# EasyEDA Pro project WKMiniFlyG4.epro

# Schematic Schematic1
Board Name: Board1; Create Date: 2025-02-15; Page Name: P1; Project Name: WKMiniFlyG4; Schematic Name: Schematic1; Update Date: 2025-03-20; Company: 嘉立创EDA; Page Size: A4; Version: V1.0
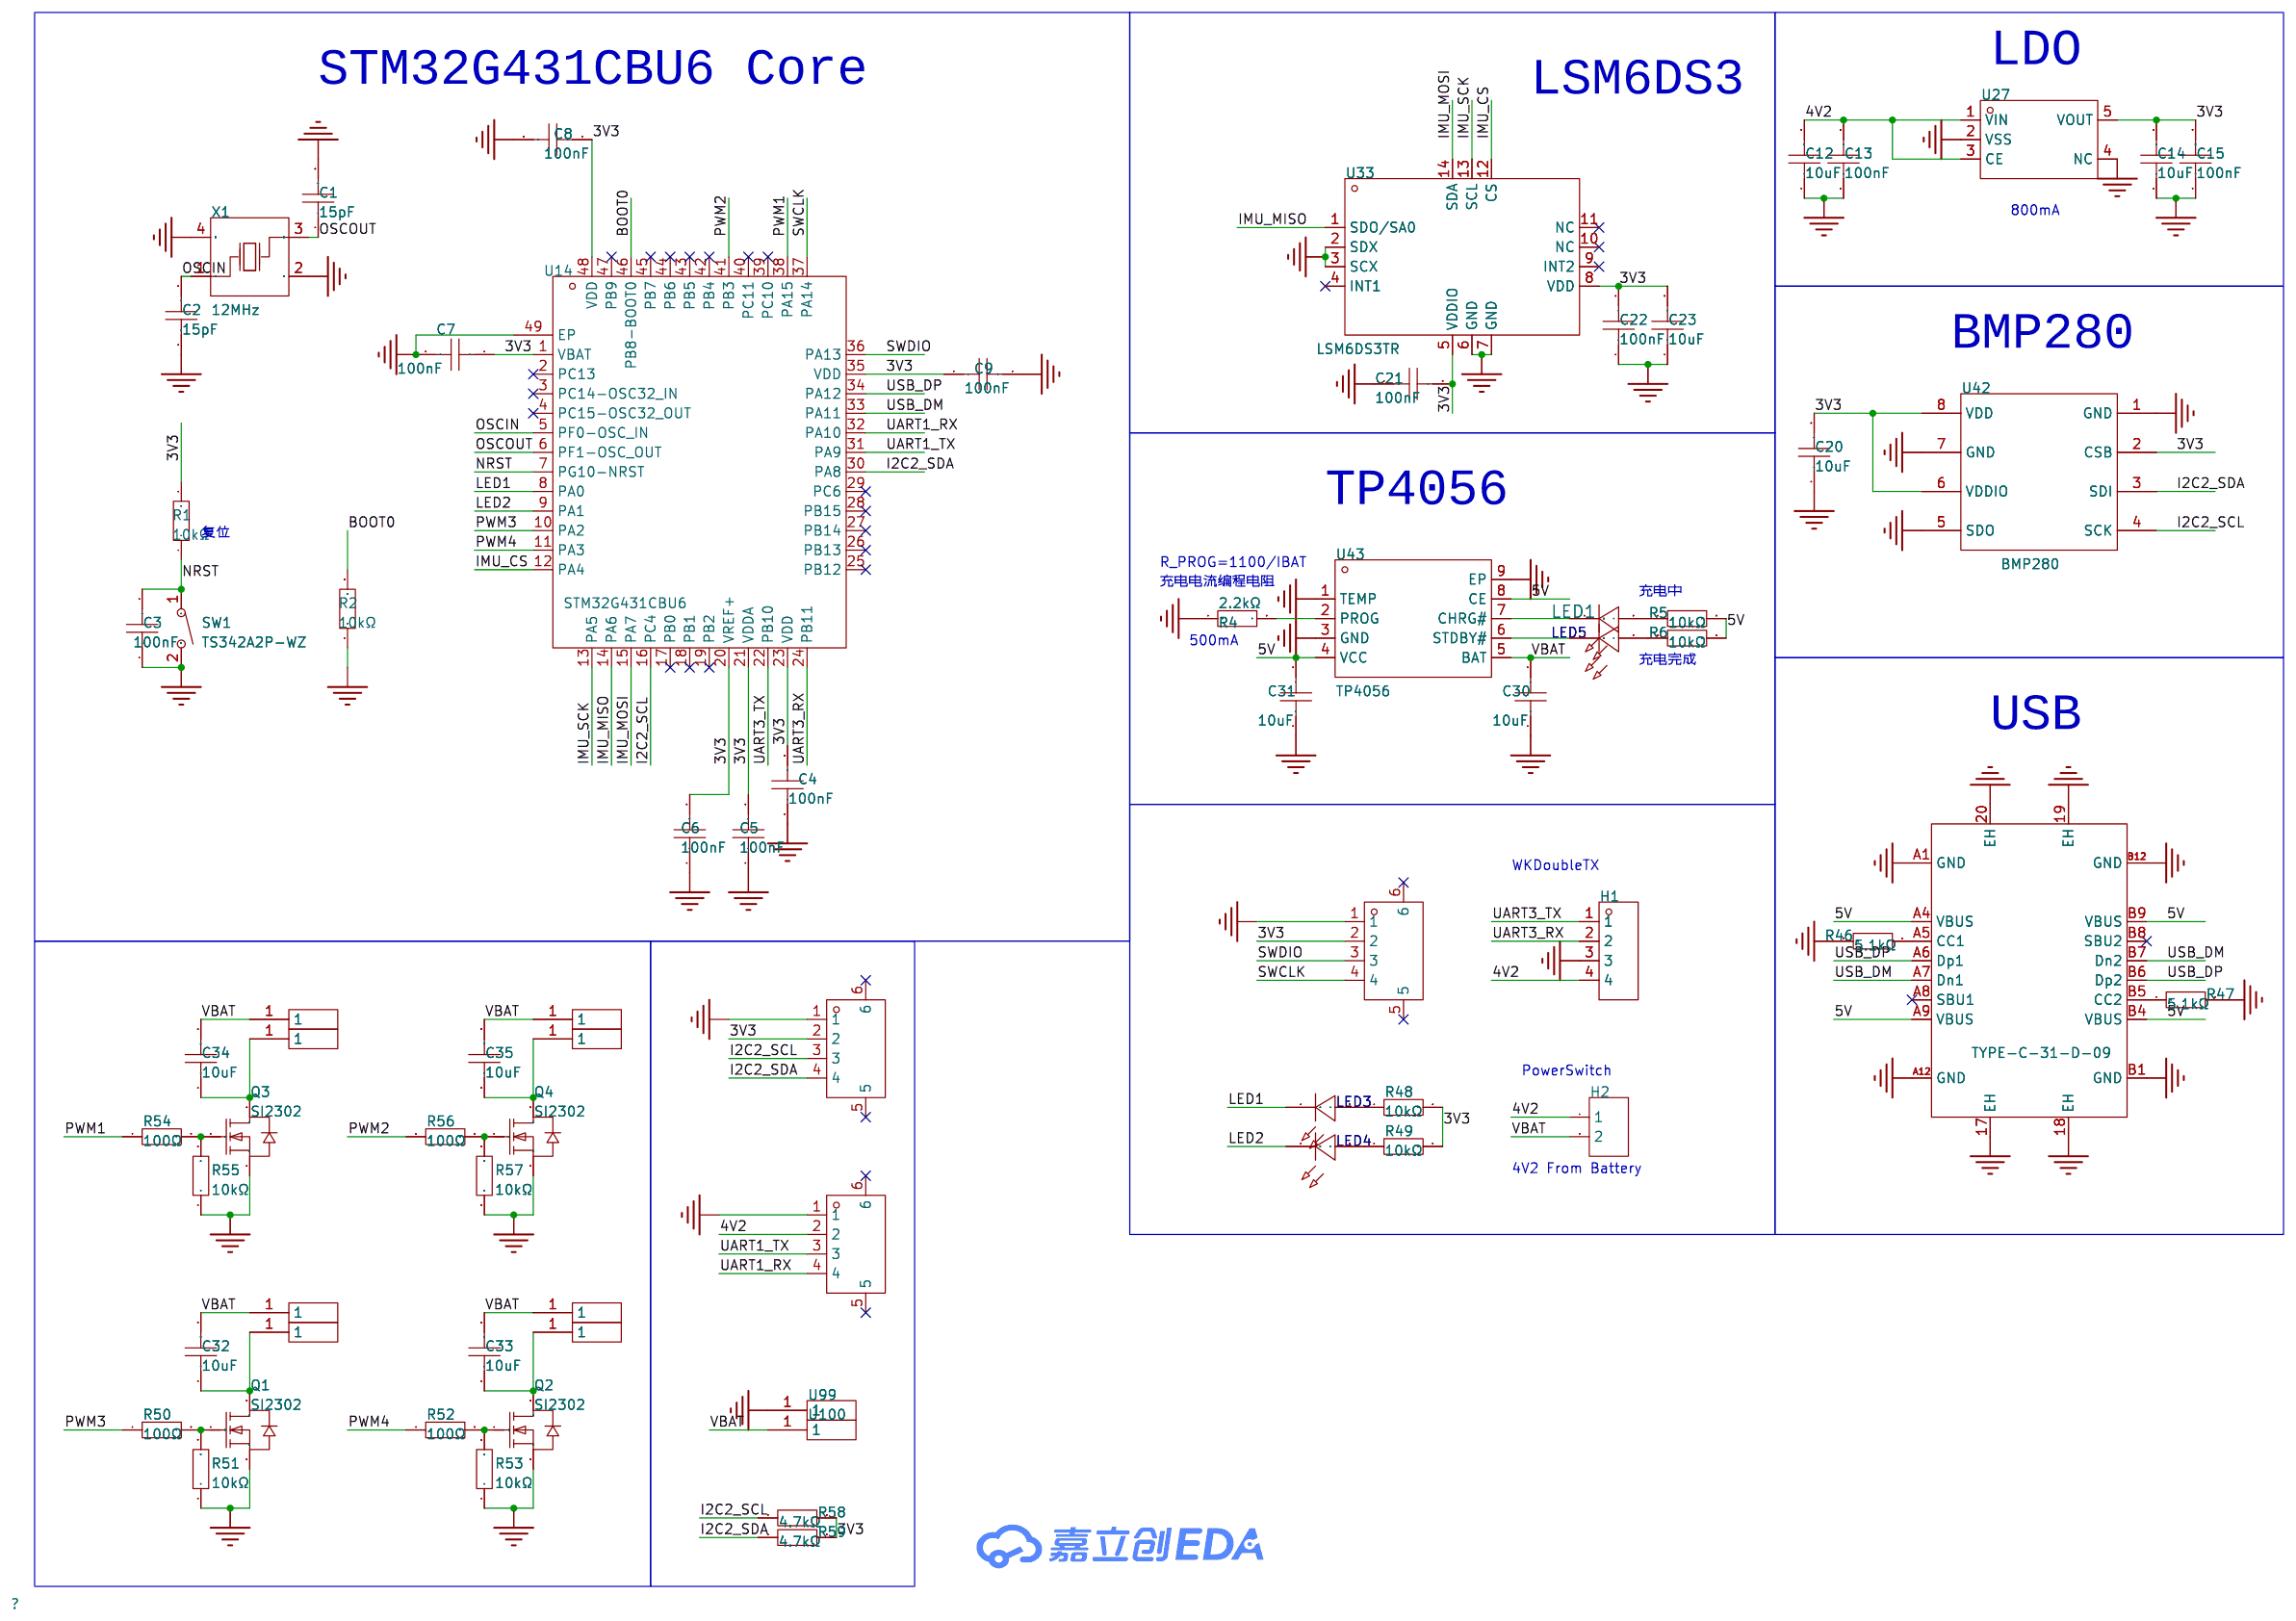
[diagram p0: schematic sheet]

## Parts
C1  15pF  [C0603]
C2  15pF  [C0603]
C3  100nF  [C0603]
C4  100nF  [C0603]
C5  100nF  [C0603]
C6  100nF  [C0603]
C7  100nF  [C0603]
C8  100nF  [C0603]
C9  100nF  [C0603]
C12  10uF  [C0603]
C13  100nF  [C0603]
C14  10uF  [C0603]
C15  100nF  [C0603]
C20  10uF  [C0603]
C21  100nF  [C0603]
C22  100nF  [C0603]
C23  10uF  [C0603]
C30  10uF  [C0603]
C31  10uF  [C0603]
C32  10uF  [C0603]
C33  10uF  [C0603]
C34  10uF  [C0603]
C35  10uF  [C0603]
H1  -  [HDR-TH_4P-P2.54-V-M]
H2  -  [HDR-TH_2P-P2.54-V-F]
LED1  -  [LED_0603]
LED3  -  [LED_0603]
LED4  -  [LED_0603]
LED5  -  [LED_0603]
Q1  SI2302  [SOT-23-3_L2.9-W1.3-P1.90-LS2.4-BR]
Q2  SI2302  [SOT-23-3_L2.9-W1.3-P1.90-LS2.4-BR]
Q3  SI2302  [SOT-23-3_L2.9-W1.3-P1.90-LS2.4-BR]
Q4  SI2302  [SOT-23-3_L2.9-W1.3-P1.90-LS2.4-BR]
R1  10kΩ  [R0603]
R2  10kΩ  [R0603]
R4  2.2kΩ  [R0603]
R5  10kΩ  [R0603]
R6  10kΩ  [R0603]
R46  5.1kΩ  [R0603]
R47  5.1kΩ  [R0603]
R48  10kΩ  [R0603]
R49  10kΩ  [R0603]
R50  100Ω  [R0603]
R51  10kΩ  [R0603]
R52  100Ω  [R0603]
R53  10kΩ  [R0603]
R54  100Ω  [R0603]
R55  10kΩ  [R0603]
R56  100Ω  [R0603]
R57  10kΩ  [R0603]
R58  4.7kΩ  [R0603]
R59  4.7kΩ  [R0603]
SW1  TS342A2P-WZ  [SW-SMD_L4.0-W2.9-LS5.0]
U14  STM32G431CBU6  [UFQFPN-48_L7.0-W7.0-P0.50-BL-EP]
U27  ME6217C33M5G  [SOT-23-5_L3.0-W1.7-P0.95-LS2.8-BR]
U33  LSM6DS3TR  [LGA-14_L3.0-W2.5-P0.50-TL]
U39  ZX-SH1.0-4PWT  [CONN-SMD_4P-P1.00_MEGASTAR_ZX-SH1.0-4PWT]
U41  ZX-SH1.0-4PWT  [CONN-SMD_4P-P1.00_MEGASTAR_ZX-SH1.0-4PWT]
U42  BMP280  [LGA-8_L2.5-W2.0-P0.65_AMP6127]
U43  TP4056  [ESOP-8_L4.9-W3.9-P1.27-LS6.0-BL-EP]
U89  TYPE-C-31-D-09  [USB-C-TH_TYPE-C-31-D-09]
U90  -  [1pin焊接引出]
U91  -  [1pin焊接引出]
U92  -  [1pin焊接引出]
U93  -  [1pin焊接引出]
U94  -  [1pin焊接引出]
U95  -  [1pin焊接引出]
U96  -  [1pin焊接引出]
U97  -  [1pin焊接引出]
U98  ZX-SH1.0-4PWT  [CONN-SMD_4P-P1.00_MEGASTAR_ZX-SH1.0-4PWT]
U99  -  [1pin焊接引出]
U100  -  [1pin焊接引出]
X1  12MHz  [OSC-SMD_4P-L3.2-W2.5-BL]

## Library data of the parts
C1 C2 = CL10C150JB8NNNC: 容值:15pF;精度:±5%;额定电压:50V;材质(温度系数):C0G;; LCSC Part Name: 15pF ±5% 50V; Supplier Part: C1644; Manufacturer: SAMSUNG(三星); Supplier Footprint: 0603; JLCPCB Part Class: Basic Part; Datasheet: https://atta.szlcsc.com/upload/public/pdf/source/20160218/1457707763339.pdf; Supplier: LCSC; Tolerance: ±5%; Voltage Rated: 50V; Temperature Coefficient: C0G
C3-C9 C13 C15 C21 C22 = CC0603KRX7R9BB104: 容值:100nF;精度:±10%;额定电压:50V;材质(温度系数):X7R;; LCSC Part Name: 100nF ±10% 50V; Supplier Part: C14663; Manufacturer: YAGEO(国巨); Supplier Footprint: 0603; JLCPCB Part Class: Basic Part; Datasheet: https://atta.szlcsc.com/upload/public/pdf/source/20180910/C282072_33301C7F631E79921B82A8DAC6BCC5B3.pdf; Supplier: LCSC; Tolerance: ±10%; Voltage Rated: 50V; Temperature Coefficient: X7R
C12 C14 C20 C23 C30-C35 = CL10A106KP8NNNC: 容值:10uF;精度:±10%;额定电压:10V;材质(温度系数):X5R;; LCSC Part Name: 10uF ±10% 10V; Supplier Part: C19702; Manufacturer: SAMSUNG(三星); Supplier Footprint: 0603; JLCPCB Part Class: Basic Part; Datasheet: https://atta.szlcsc.com/upload/public/pdf/source/20160218/1457707763339.pdf; Supplier: LCSC; Tolerance: ±10%; Voltage Rated: 10V; Temperature Coefficient: X5R
H1 = HDR-M_2.54_1x4P: Supplier Part: C492403; Supplier Footprint: 插件
H2 = HDR-F_2.54_1x2P: Supplier Part: C49661; Supplier Footprint: 插件
LED1 = LED_0603-R: Supplier Footprint: 0603
LED3-LED5 = LED_0603-G: Supplier Footprint: 0603
Q1-Q4 = SI2302_C2891732: 类型:1个N沟道;漏源电压(Vdss):20V;连续漏极电流(Id):3A;导通电阻(RDS(on)@Vgs,Id):50mΩ@4.5V,3A;功率(Pd):1W;阈值电压(Vgs(th)@Id):1V@250uA;; LCSC Part Name: N沟道,电流:3A,耐压:20V; Supplier Part: C2891732; Manufacturer: YONGYUTAI(永裕泰); Supplier Footprint: SOT-23; JLCPCB Part Class: 扩展库; Datasheet: https://atta.szlcsc.com/upload/public/pdf/source/20210901/467BBA277A18343FF82D7D641AA41F7C.pdf; Supplier: LCSC; Type: 1个N沟道; Drain Source Voltage (Vdss): 20V; Continuous Drain Current (Id): 3A; Drain Source On Resistance (RDS(on)@Vgs,Id): 50mΩ@4.5V,3A; Power Dissipation (Pd): 1W; Gate Threshold Voltage (Vgs(th)@Id): 1V@250uA; Total Gate Charge (Qg@Vgs): 60nC@4.5V; Input Capacitance (Ciss@Vds): 300pF@10V; Reverse Transfer Capacitance (Crss@Vds): 80pF@10V; Operating Temperature: -55℃~+150℃
R1 R2 R5 R6 R48 R49 R51 R53 R55 R57 = 0603WAF1002T5E: 电阻类型:厚膜电阻;阻值:10kΩ;精度:±1%;功率:100mW;最大工作电压:75V;温度系数:±100ppm/℃;; LCSC Part Name: 厚膜电阻 10kΩ ±1% 100mW; Supplier Part: C25804; Manufacturer: UNI-ROYAL(厚声); Supplier Footprint: 0603; JLCPCB Part Class: Basic Part; Datasheet: https://atta.szlcsc.com/upload/public/pdf/source/20200306/C422600_1E6D84923E4A46A82E41ADD87F860B5C.pdf; Supplier: LCSC; Type: 厚膜电阻; Tolerance: ±1%; Power(Watts): 100mW; Overload Voltage (Max): 75V; Temperature Coefficient: ±100ppm/℃; Operating Temperature Range: -55℃~+155℃
R4 = 0603WAF2201T5E: 电阻类型:厚膜电阻;阻值:2.2kΩ;精度:±1%;功率:100mW;最大工作电压:75V;温度系数:±100ppm/℃;; LCSC Part Name: 2.2kΩ ±1% 100mW 厚膜电阻; Supplier Part: C4190; Manufacturer: UNI-ROYAL(厚声); Supplier Footprint: 0603; JLCPCB Part Class: Basic Part; Datasheet: https://atta.szlcsc.com/upload/public/pdf/source/20200306/C422600_1E6D84923E4A46A82E41ADD87F860B5C.pdf; Supplier: LCSC; Type: 厚膜电阻; Tolerance: ±1%; Power(Watts): 100mW; Overload Voltage (Max): 75V; Temperature Coefficient: ±100ppm/℃; Operating Temperature Range: -55℃~+155℃
R46 R47 = 0603WAF5101T5E: 电阻类型:厚膜电阻;阻值:5.1kΩ;精度:±1%;功率:100mW;最大工作电压:75V;温度系数:±100ppm/℃;; LCSC Part Name: 5.1kΩ ±1% 100mW 厚膜电阻; Supplier Part: C23186; Manufacturer: UNI-ROYAL(厚声); Supplier Footprint: 0603; JLCPCB Part Class: Basic Part; Datasheet: https://atta.szlcsc.com/upload/public/pdf/source/20200306/C422600_1E6D84923E4A46A82E41ADD87F860B5C.pdf; Supplier: LCSC; Type: 厚膜电阻; Tolerance: ±1%; Power(Watts): 100mW; Overload Voltage (Max): 75V; Temperature Coefficient: ±100ppm/℃; Operating Temperature Range: -55℃~+155℃
R50 R52 R54 R56 = 0603WAF1000T5E: 电阻类型:厚膜电阻;阻值:100Ω;精度:±1%;功率:100mW;最大工作电压:75V;温度系数:±200ppm/℃;; LCSC Part Name: 100Ω ±1% 100mW 厚膜电阻; Supplier Part: C22775; Manufacturer: UNI-ROYAL(厚声); Supplier Footprint: 0603; JLCPCB Part Class: Basic Part; Datasheet: https://atta.szlcsc.com/upload/public/pdf/source/20200306/C422600_1E6D84923E4A46A82E41ADD87F860B5C.pdf; Supplier: LCSC; Type: 厚膜电阻; Tolerance: ±1%; Power(Watts): 100mW; Overload Voltage (Max): 75V; Temperature Coefficient: ±200ppm/℃; Operating Temperature Range: -55℃~+155℃
R58 R59 = 0603WAF4701T5E: 电阻类型:厚膜电阻;阻值:4.7kΩ;精度:±1%;功率:100mW;最大工作电压:75V;温度系数:±100ppm/℃;; LCSC Part Name: 4.7kΩ ±1% 100mW 厚膜电阻; Supplier Part: C23162; Manufacturer: UNI-ROYAL(厚声); Supplier Footprint: 0603; JLCPCB Part Class: Basic Part; Datasheet: https://atta.szlcsc.com/upload/public/pdf/source/20200306/C422600_1E6D84923E4A46A82E41ADD87F860B5C.pdf; Supplier: LCSC; Type: 厚膜电阻; Tolerance: ±1%; Power(Watts): 100mW; Overload Voltage (Max): 75V; Temperature Coefficient: ±100ppm/℃; Operating Temperature Range: -55℃~+155℃
SW1 = TS342A2P-WZ: 电路结构:单刀单掷;按钮形状:圆形按钮;安装方式:立贴;开关长度:3.95mm;开关宽度:2.9mm;开关高度:2mm;带支架:不带;触点电流:50mA;额定电压(DC):12V;绝缘电阻:100MΩ;机械寿命:3万次;; LCSC Part Name: 3.95*2.9*2mm 立贴 轻触开关; Supplier Part: C557591; Manufacturer: SHOU HAN(首韩); Supplier Footprint: SMD; JLCPCB Part Class: 扩展库; Datasheet: https://atta.szlcsc.com/upload/public/pdf/source/20200519/C557591_B3A5A21584733303F06306F18577DA8B.pdf; Supplier: LCSC; Circuit: 单刀单掷; Actuator Style: 圆形按钮; Mounting Style: 立贴; Switch Length: 3.95mm; Switch Width: 2.9mm; Switch Height: 2mm; Strike Gundam: 不带; Contact Current: 50mA; Voltage Rating (DC): 12V; Insulation Resistance: 100MΩ; Actuator/Cap Color: 黑色; Pin Style: SMD接片; Mechanical Life: 3万次; Operating Temperature: -25℃~+70℃
U14 = STM32G431CBU6: CPU内核:ARM-M系列;程序存储容量:128KB;RAM总容量:32KB;GPIO端口数量:42;工作电压范围:1.71V~3.6V;CPU最大主频:170MHz;程序存储器类型:FLASH;; Supplier Part: C529356; Manufacturer: ST(意法半导体); Supplier Footprint: UFQFPN-48(7x7); JLCPCB Part Class: 扩展库; Datasheet: https://atta.szlcsc.com/upload/public/pdf/source/20200511/C529354_7C66CF00837B904D0C15DCE45B69418C.pdf; Supplier: LCSC; CPU Core: ARM-M系列; Program Storage Size: 128KB; RAM Size: 32KB; GPIO Ports Number: 42; Operating Voltage Range: 1.71V~3.6V; CPU Maximum Speed: 170MHz; Program Memory Type: FLASH; Operating Temperature Range: -40℃~+85℃; ADC (Bit): 12bit; DAC (Bit): 12bit; Peripheral/Function: DMA；PWM; Watchdog: 有; Infrared Data Association: 有; Low-Voltage Detect: 有; Direct Memory Access: 有; Internal Oscillator: 有
U27 = ME6217C33M5G: 输出类型:固定;输出极性:正;最大输入电压:7V;输出电压:3.3V;输出电流:800mA;电源纹波抑制比(PSRR):65dB@(1kHz);; Supplier Part: C427602; Manufacturer: MICRONE(南京微盟); Supplier Footprint: SOT-23-5; JLCPCB Part Class: 扩展库; Datasheet: https://atta.szlcsc.com/upload/public/pdf/source/20190910/C427602_D4B9162A2E9D9EF57C60010DFDECEF37.pdf; Supplier: LCSC; Output Type: 固定; Output Polarity: 正; Number of Outputs: 1; Maximum Input Voltage: 7V; Output Voltage: 3.3V; Dropout Voltage: 180mV@(300mA); Output Current: 800mA; Power Supply Rejection Ratio (PSRR): 65dB@(1kHz)
U33 = LSM6DS3TR: 传感器类型:加速度计陀螺仪;; LCSC Part Name: LSM6DS3TR MSL=3; Supplier Part: C95230; Manufacturer: ST(意法半导体); Supplier Footprint: LGA-14(2.5x3); JLCPCB Part Class: 扩展库; Datasheet: https://atta.szlcsc.com/upload/public/pdf/source/20180410/C95230_E9546B888C12D8CC6F7F231B3BE24882.pdf; Supplier: LCSC; Sensor Type: 加速度计陀螺仪; Operating Temperature: -40℃~+85℃
U39 U41 U98 = ZX-SH1.0-4PWT: 插针结构:1x4P;间距:1mm;安装方式:卧贴;参考系列:SH;总PIN数:4P;排数:1;每排PIN数:4;行距:-;额定电流:-;触头材质:黄铜;触头镀层:锡;工作温度范围:-;; LCSC Part Name: 1x4P 间距:1mm 卧贴 系列:SH; Supplier Part: C7430446; Manufacturer: Megastar(兆星); Supplier Footprint: SMD,P=1mm,卧贴; JLCPCB Part Class: 扩展库; Datasheet: https://atta.szlcsc.com/upload/public/pdf/source/20230619/390816C24B7A0EB1D042395C380CEA99.pdf; Supplier: LCSC; Pins Structure: 1x4P; Pitch: 1mm; Mounting Style: 卧贴; Reference Series: SH; Number of Pins: 4P; Number of Rows: 1; Number of PINs Per Row: 4; Contact Material: 黄铜; Contact Plating: 锡; Supplementary Features: 辅助焊脚; Colour: 米色; Z-Height of the Board: 3.15mm; X-Length of Bottom Edge on Board (Spacing Line): 6.35mm; Y-Width of Bottom Edge on Board: 5.05mm
U42 = BMP280: Bosch气压传感器新品，可测量大气压力，带高精度温度测量，可校准精确计算海拔高度。I2C或SPI接口，宽量程（300-1100hpa），精度高; Supplier Part: C83291; Manufacturer: Bosch(博世); Supplier Footprint: LGA-8(2x2.5); JLCPCB Part Class: 扩展库; Datasheet: https://atta.szlcsc.com/upload/public/pdf/source/20200702/C83291_F39E84AB7DFC569A4C7554F8659640A1.pdf; Supplier: LCSC
U43 = TP4056_C382139: 工作电压:4V~6V;最大充电电流:1A;电池类型:锂离子/聚合物;电池节数:1;; LCSC Part Name: 1A锂电池充电IC; Supplier Part: C382139; Manufacturer: TPOWER(天源); Supplier Footprint: ESOP-8; JLCPCB Part Class: 扩展库; Datasheet: https://atta.szlcsc.com/upload/public/pdf/source/20190327/C382139_EC85960E6FE3E26856C240C81751A184.pdf; Supplier: LCSC; The Chip Type: 线性充电芯片; Supply Voltage: 4V~6V; Maximum Charge Current: 1A; Charging Saturation Voltage: 4.2V; Type of Battery: 锂离子/聚合物; Number of Cells: 1; Operating Temperature: -40℃~+85℃
U89 = TYPE-C-31-D-09_C7463258: 连接器类型:Type-C;公母:母;触点数量:16P;端口数量:1;触头材质:磷青铜;触头镀层:金;工作温度范围:-25℃~+85℃;焊接温度(最大值):255℃;; LCSC Part Name: Type-C 母; Supplier Part: C7463258; Manufacturer: 韩国韩荣; Supplier Footprint: 插件; JLCPCB Part Class: 扩展库; Datasheet: https://atta.szlcsc.com/upload/public/pdf/source/20210810/32473655767ED7E058BB8A709ED63A8A.pdf; Supplier: LCSC; Connector Type: Type-C; Gender: 母; Number of Contacts: 16P; Number of Ports: 1; Contact Material: 磷青铜; Contact Plating: 金; Operating Temperature Range: -25℃~+85℃; Soldering Temperature(Max): 255℃
U90-U97 U99 U100 = 1pin焊接引出: Check: false
X1 = X322512MSB4SI: 晶振类型:贴片晶振;频率:12MHz;常温频差:±10ppm;外接负载电容:20pF;频率稳定度(全温):±30ppm;; LCSC Part Name: 12MHz ±10ppm 20pF; Supplier Part: C9002; Manufacturer: YXC(扬兴晶振); Supplier Footprint: SMD3225-4P; JLCPCB Part Class: 基础库; Datasheet: https://atta.szlcsc.com/upload/public/pdf/source/20210329/C112971_1F611BDC486E193C1706F6D8EB5AA189.pdf; Supplier: LCSC; Crystal Type: 贴片晶振; Frequency Tolerance: ±10ppm; Frequency Stability: ±30ppm; Load Capacitance: 20pF; Operating Temperature: -40℃~+85℃; Normal temperature Frequency Tolerance: ±10ppm; External load capacitor: 20pF; Frequency Stability(Full temperature range): ±30ppm

## Nets
3V3: C4.2 C5.2 C6.2 C7.1 C8.1 C9.1 C14.2 C15.2 C20.2 C21.2 C22.2 C23.2 R1.2 R48.2 R49.2 R58.2 R59.2 U14.1(VBAT) U14.20(VREF+) U14.21(VDDA) U14.23(VDD) U14.35(VDD) U14.48(VDD) U27.5(VOUT) U33.5(VDDIO) U33.8(VDD) U39.2 U41.2 U42.2(CSB) U42.6(VDDIO) U42.8(VDD)
4V2: C12.2 C13.2 H1.4 H2.1 U27.1(VIN) U27.3(CE) U98.2
5V: C31.2 R5.2 R6.2 U43.4(VCC) U43.8(CE) U89.A4(VBUS) U89.A9(VBUS) U89.B4(VBUS) U89.B9(VBUS)
GND: C1.2 C2.1 C3.1 C4.1 C5.1 C6.1 C7.2 C8.2 C9.2 C12.1 C13.1 C14.1 C15.1 C20.1 C21.1 C22.1 C23.1 C30.1 C31.1 H1.3 Q1.2(S) Q2.2(S) Q3.2(S) Q4.2(S) R2.1 R4.1 R46.1 R47.2 R51.1 R53.1 R55.1 R57.1 SW1.2 U14.49(EP) U27.2(VSS) U27.4(NC) U33.2(SDX) U33.3(SCX) U33.6(GND) U33.7(GND) U39.1 U41.1 U42.1(GND) U42.5(SDO) U42.7(GND) U43.1(TEMP) U43.3(GND) U43.9(EP) U89.17(EH) U89.18(EH) U89.19(EH) U89.20(EH) U89.A1(GND) U89.A12(GND) U89.B1(GND) U89.B12(GND) U98.1 U99.1 X1.2(GND) X1.4(GND)
VBAT: C30.2 C32.2 C33.2 C34.2 C35.2 H2.2 U43.5(BAT) U90.1 U92.1 U94.1 U96.1 U100.1
BOOT0: R2.2 U14.46(PB8-BOOT0)
I2C2_SCL: R58.1 U14.16(PC4) U39.3 U42.4(SCK)
I2C2_SDA: R59.1 U14.30(PA8) U39.4 U42.3(SDI)
IMU_CS: U14.12(PA4) U33.12(CS)
IMU_MISO: U14.14(PA6) U33.1(SDO/SA0)
IMU_MOSI: U14.15(PA7) U33.14(SDA)
IMU_SCK: U14.13(PA5) U33.13(SCL)
LED1: LED3.1(C) U14.8(PA0)
LED2: LED4.1(C) U14.9(PA1)
NRST: C3.2 R1.1 SW1.1 U14.7(PG10-NRST)
OSCIN: C2.2 U14.5(PF0-OSC_IN) X1.1(OSC1)
OSCOUT: C1.1 U14.6(PF1-OSC_OUT) X1.3(OSC2)
PWM1: R54.1 U14.38(PA15)
PWM2: R56.1 U14.41(PB3)
PWM3: R50.1 U14.10(PA2)
PWM4: R52.1 U14.11(PA3)
SWCLK: U14.37(PA14) U41.4
SWDIO: U14.36(PA13) U41.3
UART1_RX: U14.32(PA10) U98.4
UART1_TX: U14.31(PA9) U98.3
UART3_RX: H1.2 U14.24(PB11)
UART3_TX: H1.1 U14.22(PB10)
USB_DM: U14.33(PA11) U89.A7(Dn1) U89.B7(Dn2)
USB_DP: U14.34(PA12) U89.A6(Dp1) U89.B6(Dp2)
$1N4477: R4.2 U43.2(PROG)
$1N4551: LED1.1(C) U43.7(CHRG#)
$1N4662: LED1.2(A) R5.1
$1N5211: R46.2 U89.A5(CC1)
$1N5212: R47.1 U89.B5(CC2)
$1N5354: LED3.2(A) R48.1
$1N5381: LED4.2(A) R49.1
$1N5596: C32.1 Q1.3(D) U95.1
$1N8554: Q1.1(G) R50.2 R51.2
$1N8848: C33.1 Q2.3(D) U97.1
$1N8858: Q2.1(G) R52.2 R53.2
$1N9017: C34.1 Q3.3(D) U91.1
$1N9027: Q3.1(G) R54.2 R55.2
$1N9186: C35.1 Q4.3(D) U93.1
$1N9196: Q4.1(G) R56.2 R57.2
Net-(LED5-1): LED5.1(C) U43.6(STDBY#)
Net-(LED5-2): LED5.2(A) R6.1

Not connected (* = marked no-connect by the designer): U14 2(PC13)* 3(PC14-OSC32_IN)* 4(PC15-OSC32_OUT)* 17(PB0)* 18(PB1)* 19(PB2)* 25(PB12)* 26(PB13)* 27(PB14)* 28(PB15)* 29(PC6)* 39(PC10)* 40(PC11)* 42(PB4)* 43(PB5)* 44(PB6)* 45(PB7)* 47(PB9)*; U33 4(INT1)* 9(INT2)* 10(NC)* 11(NC)*; U39 5* 6*; U41 5* 6*; U89 A8(SBU1)* B8(SBU2)*; U98 5* 6*

## Notes on the sheet
- LDO
- STM32G431CBU6 Core
- LSM6DS3
- 800mA
- BMP280
- TP4056
- 复位
- R_PROG=1100/IBAT
- 充电电流编程电阻
- 充电中
- 500mA
- 充电完成
- USB
- WKDoubleTX
- PowerSwitch
- 4V2 From Battery

# Board PCB1
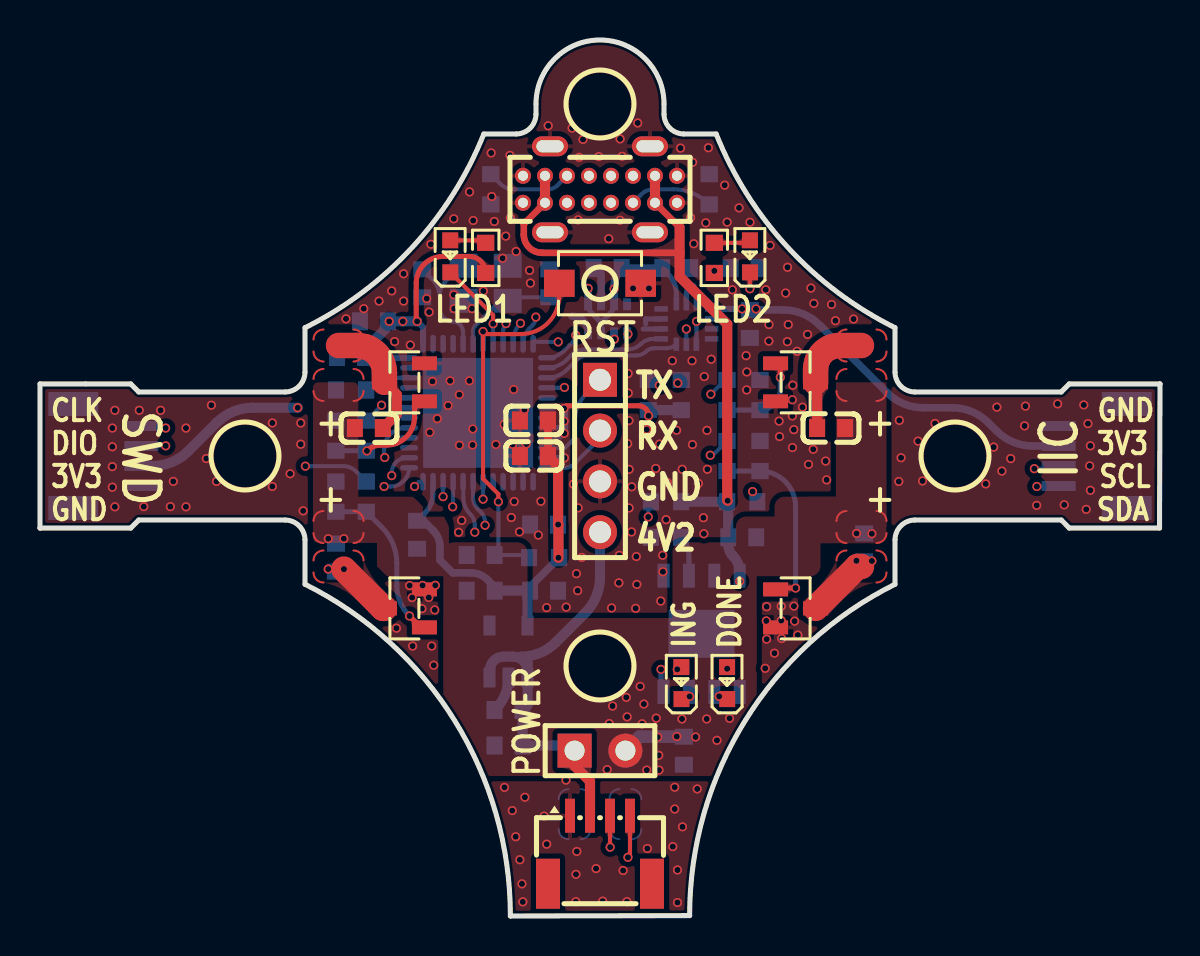
[diagram p1: board, top side]
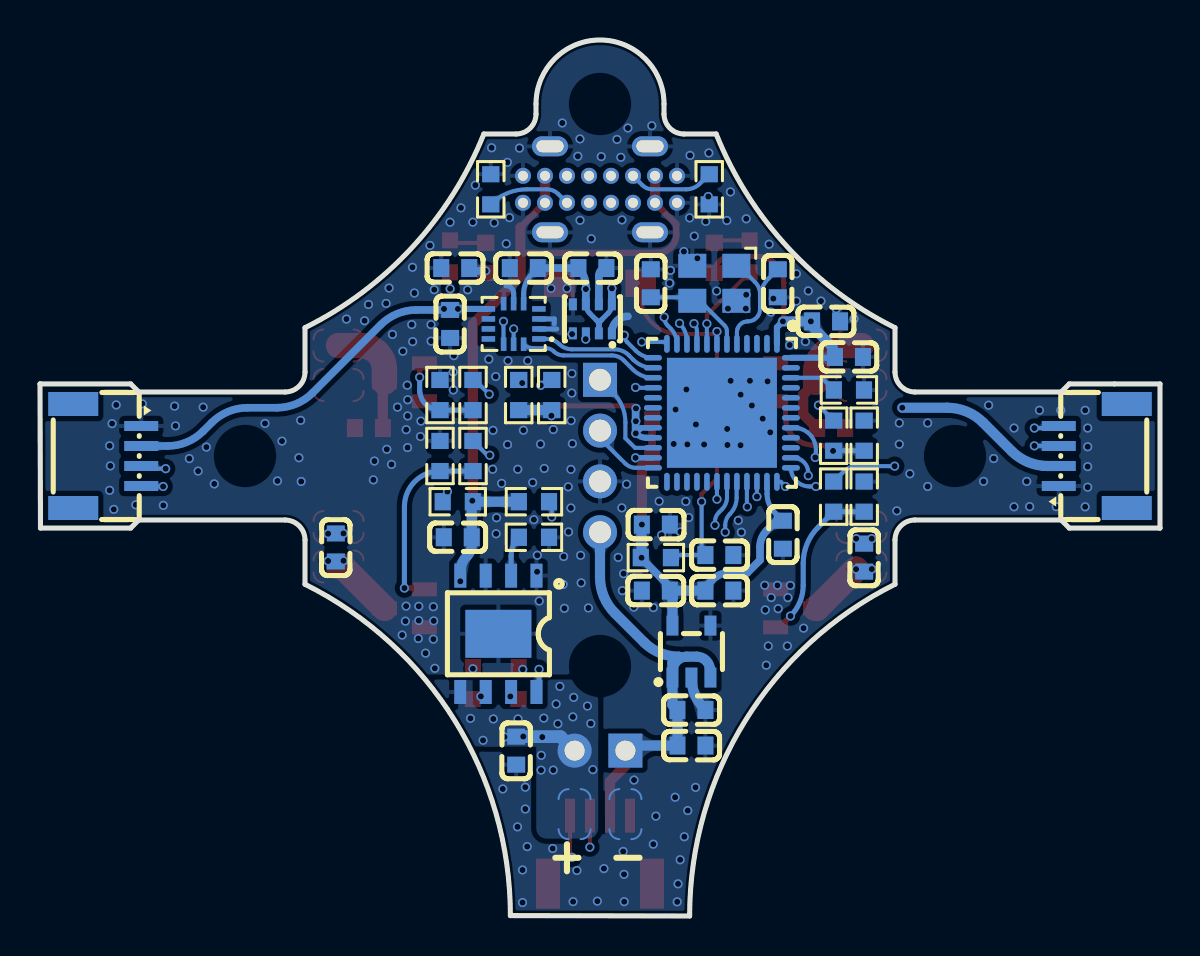
[diagram p2: board, bottom side, seen from below]

Outline 56 x 43.8 mm; copper layers: Top Layer, Inner1, Inner2, Bottom Layer. Coordinates in mm from the lower left corner of the outline.
Outline path: 0,26.6 0,19.4 4.53,19.4 4.94,19.8 12.25,19.8 arc(12.96,19.51) 13.25,18.8 13.25,16.59 arc(20.74,9.75) 23.52,0 32.48,0.02 arc(35.26,9.77) 42.75,16.59 42.75,18.8 arc(43.04,19.51) 43.75,19.8 51.06,19.8 51.47,19.4 55.98,19.4 56,26.6 51.47,26.6 51.06,26.2 43.75,26.2 arc(43.04,26.49) 42.75,27.2 42.75,29.41 arc(37.39,33.43) 33.81,39.1 32.2,39.1 arc(31.49,39.39) 31.2,40.1 31.2,40.6 arc(28,43.8) 24.8,40.6 24.8,40.1 arc(24.51,39.39) 23.8,39.1 22.19,39.1 arc(18.61,33.43) 13.25,29.41 13.25,27.2 arc(12.96,26.49) 12.25,26.2 4.94,26.2 4.53,26.6 0,26.6
Stack: Top Layer 0.035mm 外层铜厚1oz / Dielectric1 0.2104mm 7628 RC49% 8.6mil / Inner1 0.0152mm 内层铜厚 / Dielectric2 1.065mm 1.1mm H/HOZ Copper / Inner2 0.0152mm 内层铜厚 / Dielectric3 0.2104mm 7628 RC49% 8.6mil / Bottom Layer 0.035mm 外层铜厚1oz

## Design rules (mm)
template: 自定义配置
spacing copperThickness1oz (default): track to track 0.102, other pairs 0.152 to 0.3
spacing copperThickness2oz: track to track 0.203, other pairs 0.152 to 0.3
track width copperThickness1oz (default): min 0.127, default 0.254, max 2.54
track width copperThickness2oz: min 0.203, default 0.254, max 2.54
differential pair differentialPair (default): width min 0.127, default 0.254, max 2.54; gap min 0.152, default 0.152
via viaSize (default): diameter min 0.254, default 0.457, max 10; hole min 0.3, default 0.305, max 6.299

## Placement (name value [footprint] x y rotation side)
C1  15pF  [C0603]  25.46 31.64 90 bottom
C2  15pF  [C0603]  19.11 31.64 90 bottom
C3  100nF  [C0603]  22.03 18.05 0 bottom
C4  100nF  [C0603]  25.21 19.57 0 bottom
C5  100nF  [C0603]  24.7 23 0 top
C6  100nF  [C0603]  24.7 24.78 0 top
C7  100nF  [C0603]  16.7 29.73 180 bottom
C8  100nF  [C0603]  15.55 27.95 180 bottom
C9  100nF  [C0603]  18.86 19.06 270 bottom
C12  10uF  [C0603]  23.43 8.52 0 bottom
C13  100nF  [C0603]  23.43 10.3 0 bottom
C14  10uF  [C0603]  22.03 16.27 0 bottom
C15  100nF  [C0603]  25.21 16.27 180 bottom
C20  10uF  [C0603]  28.38 32.4 0 bottom
C21  100nF  [C0603]  35.49 29.6 90 bottom
C22  100nF  [C0603]  31.81 32.4 180 bottom
C23  10uF  [C0603]  35.24 32.4 180 bottom
C30  10uF  [C0603]  32.19 8.27 90 bottom
C31  10uF  [C0603]  35.11 18.94 180 bottom
C32  10uF  [C0603]  14.79 17.92 90 bottom
C33  10uF  [C0603]  16.44 24.4 180 top
C34  10uF  [C0603]  41.21 18.43 90 bottom
C35  10uF  [C0603]  39.56 24.4 0 top
H1  -  [HDR-TH_4P-P2.54-V-M]  28 23 270 top
H2  -  [HDR-TH_2P-P2.54-V-F]  28 8.27 0 top
LED1  -  [LED_0603]  32.06 11.7 90 top
LED2  -  [LED_0603]  34.35 11.7 90 top
LED3  -  [LED_0603]  20.51 33.03 90 top
LED4  -  [LED_0603]  35.49 33.03 90 top
Q1  SI2302  [SOT-23-3_L2.9-W1.3-P1.90-LS2.4-BR]  18.22 15.38 0 top
Q2  SI2302  [SOT-23-3_L2.9-W1.3-P1.90-LS2.4-BR]  18.22 26.68 0 top
Q3  SI2302  [SOT-23-3_L2.9-W1.3-P1.90-LS2.4-BR]  37.78 15.38 180 top
Q4  SI2302  [SOT-23-3_L2.9-W1.3-P1.90-LS2.4-BR]  37.78 26.68 180 top
R1  10kΩ  [R0603]  25.21 17.92 0 bottom
R2  10kΩ  [R0603]  15.55 26.3 0 bottom
R4  2.2kΩ  [R0603]  31.3 18.94 0 bottom
R5  10kΩ  [R0603]  31.3 20.71 0 bottom
R6  10kΩ  [R0603]  35.11 20.71 180 bottom
R46  5.1kΩ  [R0603]  33.46 36.33 270 bottom
R47  5.1kΩ  [R0603]  22.54 36.33 270 bottom
R48  10kΩ  [R0603]  22.28 32.91 270 top
R49  10kΩ  [R0603]  33.72 32.91 270 top
R50  100Ω  [R0603]  16.32 20.97 270 bottom
R51  10kΩ  [R0603]  14.79 20.97 270 bottom
R52  100Ω  [R0603]  16.32 24.02 270 bottom
R53  10kΩ  [R0603]  14.79 24.02 270 bottom
R54  100Ω  [R0603]  34.35 23 270 bottom
R55  10kΩ  [R0603]  36 23 270 bottom
R56  100Ω  [R0603]  34.35 26.05 270 bottom
R57  10kΩ  [R0603]  36 26.05 270 bottom
R58  4.7kΩ  [R0603]  32.06 26.05 270 bottom
R59  4.7kΩ  [R0603]  30.41 26.05 270 bottom
SW1  TS342A2P-WZ  [SW-SMD_L4.0-W2.9-LS5.0]  28 31.64 0 top
U14  STM32G431CBU6  [UFQFPN-48_L7.0-W7.0-P0.50-BL-EP]  21.9 25.16 0 bottom
U27  ME6217C33M5G  [SOT-23-5_L3.0-W1.7-P0.95-LS2.8-BR]  23.43 13.22 270 bottom
U33  LSM6DS3TR  [LGA-14_L3.0-W2.5-P0.50-TL]  32.32 29.6 0 bottom
U39  ZX-SH1.0-4PWT  [CONN-SMD_4P-P1.00_MEGASTAR_ZX-SH1.0-4PWT]  52.64 23 270 bottom
U41  ZX-SH1.0-4PWT  [CONN-SMD_4P-P1.00_MEGASTAR_ZX-SH1.0-4PWT]  3.36 23 90 bottom
U42  BMP280  [LGA-8_L2.5-W2.0-P0.65_AMP6127]  28.38 29.86 270 bottom
U43  TP4056  [ESOP-8_L4.9-W3.9-P1.27-LS6.0-BL-EP]  33.08 14.11 0 bottom
U89  TYPE-C-31-D-09  [USB-C-TH_TYPE-C-31-D-09]  28 36.33 180 top
U90  -  [1pin焊接引出]  41.07 19.45 0 top
U91  -  [1pin焊接引出]  41.07 17.48 0 top
U92  -  [1pin焊接引出]  41.07 26.55 0 top
U93  -  [1pin焊接引出]  41.07 28.52 0 top
U94  -  [1pin焊接引出]  14.93 19.45 0 top
U95  -  [1pin焊接引出]  14.93 17.48 0 top
U96  -  [1pin焊接引出]  14.93 26.55 0 top
U97  -  [1pin焊接引出]  14.93 28.52 0 top
U98  ZX-SH1.0-4PWT  [CONN-SMD_4P-P1.00_MEGASTAR_ZX-SH1.0-4PWT]  28 3.31 0 top
U99  -  [1pin焊接引出]  26.73 5.09 270 bottom
U100  -  [1pin焊接引出]  29.27 5.09 270 bottom
X1  12MHz  [OSC-SMD_4P-L3.2-W2.5-BL]  22.28 31.64 0 bottom

## Footprints (pads in the part's own frame, mm; a bottom-side part is the same pattern mirrored in y, then rotated)
1pin焊接引出
  custom 2.5x1.6 smd: 1(0,0)
C0603
  rect 0.8x0.9 smd: 1(-0.7,0) 2(0.7,0)
CONN-SMD_4P-P1.00_MEGASTAR_ZX-SH1.0-4PWT
  rect 0.5x1.7 smd: 1(-1.5,1.7) 2(-0.5,1.7) 3(0.5,1.7) 4(1.5,1.7)
  rect 1.2x2.5 smd: 5(2.6,-1.7) 6(-2.6,-1.7)
ESOP-8_L4.9-W3.9-P1.27-LS6.0-BL-EP
  rect 0.6x1.2 smd: 1(-1.905,-2.909) 2(-0.635,-2.909) 3(0.635,-2.909) 4(1.905,-2.909) 5(1.905,2.909) 6(0.635,2.909) 7(-0.635,2.909) 8(-1.905,2.909)
  rect 3.3x2.4 smd: 9(0,0)
HDR-TH_2P-P2.54-V-F
  rect 1.7x1.7 hole 1: 1(-1.27,0)
  round 1.7 hole 1: 2(1.27,0)
HDR-TH_4P-P2.54-V-M
  rect 1.7x1.7 hole 1.1: 1(-3.81,0)
  round 1.7 hole 1.1: 2(-1.27,0) 3(1.27,0) 4(3.81,0)
LED_0603
  rect 0.8x0.8 smd: 1(-0.851,-0.01) 2(0.75,-0.005)
LGA-8_L2.5-W2.0-P0.65_AMP6127
  rect 0.6x0.4 smd: 1(0.725,0.975) 2(0.725,0.325) 3(0.725,-0.325) 4(0.725,-0.975) 5(-0.725,-0.975) 6(-0.725,-0.325) 7(-0.725,0.325) 8(-0.725,0.975)
LGA-14_L3.0-W2.5-P0.50-TL
  rect 0.675x0.28 smd: 1(-1.262,0.75) 2(-1.262,0.25) 3(-1.262,-0.25) 4(-1.262,-0.75) 8(1.262,-0.75) 9(1.262,-0.25) 10(1.262,0.25) 11(1.262,0.75)
  rect 0.28x0.675 smd: 5(-0.5,-1.012) 6(0,-1.012) 7(0.5,-1.012) 12(0.5,1.012) 13(0,1.012) 14(-0.5,1.012)
OSC-SMD_4P-L3.2-W2.5-BL
  rect 1.4x1.2 smd: 1(-1.1,-0.875) 2(1.1,-0.875) 3(1.1,0.875) 4(-1.1,0.875)
R0603
  rect 0.806x0.864 smd: 1(-0.753,0) 2(0.753,0)
SOT-23-3_L2.9-W1.3-P1.90-LS2.4-BR
  rect 1.25x0.7 smd: 1(1,-0.95) 2(1,0.95) 3(-1,0)
SOT-23-5_L3.0-W1.7-P0.95-LS2.8-BR
  rect 1x0.6 smd: 1(1.3,-0.95) 2(1.3,0) 3(1.3,0.95) 4(-1.3,0.95) 5(-1.3,-0.95)
SW-SMD_L4.0-W2.9-LS5.0
  rect 1.53x1.36 smd: 1(-2.035,0) 2(2.035,0)
UFQFPN-48_L7.0-W7.0-P0.50-BL-EP
  oval 0.28x0.9 smd: 1(-2.751,-3.45) 2(-2.251,-3.45) 3(-1.75,-3.45) 4(-1.25,-3.45) 5(-0.749,-3.45) 6(-0.249,-3.45) 7(0.249,-3.45) 8(0.75,-3.45) 9(1.25,-3.45) 10(1.75,-3.45) 11(2.251,-3.45) 12(2.751,-3.45) 25(2.751,3.449) 26(2.251,3.449) 27(1.75,3.449) 28(1.25,3.449) 29(0.75,3.449) 30(0.249,3.449) 31(-0.249,3.449) 32(-0.749,3.449) 33(-1.25,3.449) 34(-1.75,3.449) 35(-2.251,3.449) 36(-2.751,3.449)
  oval 0.9x0.28 smd: 13(3.45,-2.751) 14(3.45,-2.251) 15(3.45,-1.75) 16(3.45,-1.25) 17(3.45,-0.75) 18(3.45,-0.249) 19(3.45,0.249) 20(3.45,0.749) 21(3.45,1.25) 22(3.45,1.75) 23(3.45,2.251) 24(3.45,2.751) 37(-3.449,2.751) 38(-3.449,2.251) 39(-3.449,1.75) 40(-3.449,1.25) 41(-3.449,0.749) 42(-3.449,0.249) 43(-3.449,-0.249) 44(-3.449,-0.75) 45(-3.449,-1.25) 46(-3.449,-1.75) 47(-3.449,-2.251) 48(-3.449,-2.751)
  rect 5.5x5.5 smd: 49(0,0)
USB-C-TH_TYPE-C-31-D-09
  oval 1.8x1 hole 1.365x0.6: 17(2.5,2.15) 18(-2.5,2.15) 19(-2.5,-2.15) 20(2.5,-2.15)
  round 0.8 hole 0.5: A1(-3.85,0.675) A4(-2.75,0.675) A5(-1.65,0.675) A6(-0.55,0.675) A7(0.55,0.675) A8(1.65,0.675) A9(2.75,0.675) A12(3.85,0.675) B1(3.85,-0.675) B4(2.75,-0.675) B5(1.65,-0.675) B6(0.55,-0.675) B7(-0.55,-0.675) B8(-1.65,-0.675) B9(-2.75,-0.675) B12(-3.85,-0.675)

## Nets
As in the schematic, except:
$1N4555: LED2.1 U43.6
$1N4716: LED2.2 R6.1

Pads without a net: U14 17 18 19 25 26 27 28 29 47; U33 4 9 10 11; U39 5 6; U41 5 6; U89 A8 B8; U98 5 6

## Via types
v1: diameter 0.457, hole 0.305, Top Layer to Bottom Layer, 328 vias

## Routing (per net, layer and track width the routed paths; a pad name or vN(x,y) marks a point on that pad's centre or on a via; arc(x,y) is an arc through that point)
3V3: length 120.9
  Top Layer w0.254: 18.85,29.73 18.81,29.77 18.81,31.64 arc(19.2,32.59) 20.15,32.98 21.46,32.98 arc(22.04,32.74) R48.2 ; 26.2,25.38 26.33,25.51 29.93,25.51 arc(30.28,25.37) v1(30.43,25.01)
  Top Layer w0.381: C6.2 C5.2
  Top Layer w0.508: C5.2 25.91,22.49 v1(25.91,19.57) 25.92,19.56 v1(25.92,17.91)
  Inner1 w0.508: v1(12.89,25.41) 17.03,29.55 arc(17.22,29.68) v1(17.46,29.73)
  Inner2 w0.457: 25.76,25.82 v1(26.2,25.38) ; 25.76,25.82 25.1,26.48 arc(24.55,27.3) 24.36,28.28 24.36,28.33 ; 25.76,25.82 arc(25.95,25.59) 26.09,25.33 arc(26.18,25.04) v1(26.21,24.74) ; v1(26.21,24.13) 26.21,24.74
  Inner2 w0.635: v1(18.14,29.73) 18.03,29.73 ; 18.03,29.73 v1(17.46,29.73) ; 18.03,29.73 arc(18.42,29.7) 18.81,29.59 arc(19.26,29.37) 19.66,29.05 arc(20.46,28.52) 21.4,28.33 24.36,28.33 v1(27.41,31.38)
  Inner2 w0.762: v1(27.41,31.38) 28.67,31.38 arc(28.7,31.37) v1(28.71,31.35) arc(28.99,30.65) 29.69,30.37 31.82,30.37 arc(32.54,30.52) 33.14,30.95 arc(33.26,31.11) 33.37,31.28 ; v1(35.8,30.35) v1(35.1,30.35) 34.3,30.35 arc(33.64,30.63) 33.37,31.28 ; v1(33.72,32.26) 33.59,32.13 arc(33.53,31.69) 33.37,31.28
  Bottom Layer w0.254: 28.19,29.81 28.52,30.14 arc(28.66,30.34) U42.6 ; 28.19,29.81 28.06,29.67 ; 28.19,29.81 arc(28.09,29.66) 28.06,29.49 ; C22.2 31.4,32.11 arc(31.71,31.65) 31.82,31.1 U33.5 ; 28.06,29.49 28.06,29.13 ; 28.06,29.49 28.06,29.67 ; 28.06,29.49 arc(28.02,29.66) 27.92,29.81 ; 28.06,29.67 27.92,29.81 ; U14.35 19.65,21.35 19.65,21.34 19.65,21.1 arc(19.55,20.59) 19.26,20.17 C9.1 ; 27.92,29.81 27.59,30.14 arc(27.45,30.34) U42.8
  Bottom Layer w0.28: U14.23 26.22,22.91 ; U14.20 25.93,24.41 v1(26.21,24.13)
  Bottom Layer w0.305: U14.21 25.67,23.91 arc(25.96,23.97) v1(26.21,24.13) ; U14.1 19.15,29.43 v1(18.86,29.73) ; C21.2 35.44,30.35 v1(35.1,30.35) U33.8 ; 18.46,27.91 16.3,27.91 C8.1
  Bottom Layer w0.381: R1.2 24.51,16.47 C15.2 ; C23.2 34.4,32.26 v1(33.72,32.26) ; C9.1 19.17,19.76 19.66,19.27 arc(19.91,18.9) 20,18.46 20,17.79 20.63,17.16 21.54,17.16 arc(21.99,17.07) 22.38,16.81 22.73,16.46 C14.2 ; U42.8 v1(27.41,31.38) ; 26.22,25.39 26.22,24.13 ; U42.6 v1(28.71,31.35) 28.71,31.49 arc(28.8,31.98) C20.2 C22.2 ; U39.2 49.63,23.5 arc(48.66,23.69) 47.84,24.24 47.41,24.67 arc(46.59,25.22) 45.62,25.41 44.16,25.41 arc(43.19,25.61) 42.37,26.16 38.97,29.56 arc(38.14,30.11) 37.17,30.3 C21.2
  Bottom Layer w0.508: R58.2 R59.2 ; U41.2 5.62,22.5 arc(6.59,22.69) 7.42,23.24 8.84,24.67 arc(9.67,25.22) 10.64,25.41 v1(12.89,25.41) ; C14.2 C15.2 24.38,16.14 U27.5 ; v1(18.86,29.73) v1(18.14,29.73) C7.1 arc(17.36,29.53) 17.27,29.36 arc(17.24,29.33) 17.22,29.3 16.52,28.6 arc(16.42,28.49) 16.35,28.35 arc(16.28,28.16) C8.1 ; v1(25.92,17.91) 25.92,19.56 v1(25.91,19.57)
  vias: v1(26.22,22.91)
4V2: length 22.2
  Top Layer w0.508: H2.1 26.73,7.51 27.5,6.74 U98.2
  Bottom Layer w0.508: H2.1 26.48,8.52 C12.2 C13.2 24.38,10.55 U27.1 24.38,12.65 24.06,12.97 arc(25,13.15) 25.8,13.69 27.26,15.14 arc(27.81,15.97) 28,16.94 H1.4 ; 22.48,12.29 U27.3 ; 22.5,12.29 arc(22.69,12.77) 23.17,12.97 23.67,12.97 arc(24.16,12.77) 24.36,12.28
5V: length 42.8
  Top Layer w0.33: 31.98,33.15 31.97,33.16 25.1,33.16 arc(24.46,33.43) 24.19,34.07 24.19,34.6 U89.A9 ; U89.A4 31.98,34.43
  Top Layer w0.508: v1(34.38,20.76) 34.36,20.79 34.36,29.59 31.98,31.97 31.98,34.43 ; U89.B9 U89.A4 ; U89.A9 U89.B4
  Inner1 w0.254: v1(34.99,16.73) 31.38,13.13 arc(31.13,12.76) v1(31.05,12.33)
  Bottom Layer w0.254: U43.8 31.05,11.33 v1(31.05,12.33)
  Bottom Layer w0.508: U43.4 34.99,17.19 arc(34.9,17.63) 34.65,18 arc(34.47,18.26) 34.41,18.57 C31.2 34.41,20.66 R6.2 R5.2
GND: length 8.2
  Bottom Layer w0.254: 30.29,29.6 30.29,29.85 U33.3 ; U33.6 32.32,31.13 arc(32.43,31.4) 32.7,31.51 ; 30.16,29.35 31.05,29.35 arc(31.05,29.35) U33.2
  Bottom Layer w0.381: U42.7 28.06,32.02 arc(27.95,32.29) C20.1 ; 27.41,29.13 27.41,29.18 arc(27.17,29.75) 26.6,29.98
  Bottom Layer w0.508: C13.1 22.78,10.35 arc(23.26,11.07) U27.2
  vias: v1(3.62,24.4) v1(3.62,23.46) v1(3.62,22.47) v1(3.62,21.44) v1(3.74,25.29) v1(3.74,20.46) v1(4.96,25.29) v1(5.19,20.47) v1(6.03,25.29) v1(6.52,20.47) v1(6.66,21.73) v1(7.3,24.4) v1(7.3,20.46) v1(8.31,22.87) v1(8.57,25.54) v1(8.82,21.73) v1(11.62,24.65) v1(11.62,21.48) v1(12.51,22.11) v1(13.04,24.65) v1(13.04,23.59) v1(13.16,20.26) v1(15.3,29.86) v1(16.19,30.37) v1(16.95,30.75) v1(17.59,31.25) v1(17.73,28.72) v1(17.82,14.39) v1(18.18,32.11) v1(18.18,30.75) v1(18.51,28.55) v1(18.48,16.53) v1(18.61,15.92) v1(18.63,13.5) v1(19.13,16.53) v1(19.09,15.36) v1(19.33,30.87) v1(19.44,15.92) v1(19.54,33.59) v1(19.46,30.2) v1(19.49,24.18) v1(19.62,26.73) v1(19.59,13.5) v1(19.74,15.3) v1(19.69,12.54) v1(19.76,16.54) v1(19.86,24.87) v1(20.41,25.52) v1(20.5,26.76) v1(20.69,34.86) v1(20.69,31.06) v1(20.71,30.37) v1(20.93,19.19) v1(20.97,26.07) v1(20.97,23.54) v1(21.08,19.78) v1(21.48,36.2) v1(21.47,26.76) v1(21.6,30.37) v1(21.64,24.35) v1(21.63,23.55) v1(21.66,34.77) v1(22.17,31.25) v1(22.56,38.15) v1(22.59,35.97) v1(22.72,34.73) v1(22.8,23.57) v1(23.13,32.89) v1(23.21,24.58) v1(23.22,6.43) v1(23.29,33.99) v1(23.5,38.03) v1(23.52,34.91) v1(23.63,23.58) v1(23.57,19.92) v1(23.61,5.27) v1(23.68,26.33) v1(23.71,20.73) v1(23.81,33.23) v1(23.79,3.96) v1(23.98,19.21) v1(23.99,2.81) v1(24.1,1.61) v1(24.14,0.71) v1(24.22,25.32) v1(24.24,5.94) v1(24.31,23.6) v1(24.48,32.28) v1(24.52,31.64) v1(24.92,19.05) v1(25.04,20.74) v1(25.21,4.99) v1(25.33,15.42) v1(25.34,3.59) v1(25.41,39.51) v1(26.31,15.44) v1(26.3,6.8) v1(26.6,39.4) v1(26.67,21.59) v1(26.82,17.12) v1(26.84,3.23) v1(26.8,2.08) v1(26.79,0.72) v1(26.9,34.8) v1(26.91,20.41) v1(26.88,16.27) v1(26.96,37.94) v1(27.09,17.93) v1(27.15,38.83) v1(27.8,2.37) v1(27.94,37.97) v1(28.13,0.74) v1(28.44,33.86) v1(28.58,15.4) v1(28.94,16.66) v1(29,38.85) v1(29,34.79) v1(28.97,18.03) v1(29.11,37.99) v1(29.15,2.28) v1(29.35,0.72) v1(29.41,27.12) v1(29.41,26.15) v1(29.45,24.77) v1(29.38,23.62) v1(29.46,22.33) v1(29.46,20.4) v1(29.59,21.46) v1(29.57,19.2) v1(29.65,31.38) v1(29.82,17.97) v1(29.84,16.58) v1(29.78,15.38) v1(29.89,39.65) v1(30.34,24.32) v1(30.45,31.38) v1(30.37,3.37) v1(30.79,22.38) v1(30.98,23.59) v1(31.04,15.75) v1(31.13,18.04) v1(31.15,17.21) v1(31.31,19.81) v1(31.37,21.67) v1(31.61,27.76) v1(31.64,3.47) v1(31.74,6.44) v1(31.74,5.35) v1(31.83,24.29) v1(31.87,2.3) v1(31.87,0.67) v1(32.03,38.39) v1(32.11,22.34) v1(32.12,4.46) v1(32.53,34.92) v1(32.63,37.68) v1(32.6,27.76) v1(32.62,23.57) v1(32.69,33.61) v1(32.92,21.63) v1(32.86,6.35) v1(33.21,26.97) v1(33.17,19.91) v1(33.19,19.11) v1(33.29,34.66) v1(33.35,24.28) v1(33.42,38.41) v1(33.37,22.34) v1(33.56,27.84) v1(34.23,36.54) v1(34.36,34.69) v1(34.62,31.31) v1(34.95,35.41) v1(35.31,28.02) v1(35.34,27.2) v1(35.34,26.3) v1(35.5,34.69) v1(36.29,31.31) v1(36.33,15.46) v1(36.31,14.75) v1(36.33,13.84) v1(36.26,12.38) v1(36.45,29.57) v1(36.44,28.74) v1(36.5,33.53) v1(36.72,13.14) v1(36.95,24.75) v1(36.98,23.97) v1(37.06,15.49) v1(37.06,14.77) v1(37.08,13.87) v1(37.28,31.15) v1(37.38,32.44) v1(37.41,29.57) v1(37.37,28.72) v1(37.64,26.54) v1(37.62,25.81) v1(37.62,25) v1(37.62,23.42) v1(37.69,24.32) v1(37.7,15.49) v1(37.73,14.74) v1(37.86,28.24) v1(37.89,14.05) v1(38.12,25.44) v1(38.38,29.08) v1(38.43,22.58) v1(38.55,31.4) v1(38.69,30.63) v1(38.66,23.33) v1(39.28,22.75) v1(39.33,21.81) v1(39.58,30.58) v1(39.77,29.76) v1(40.68,29.85) v1(42.94,21.73) v1(42.97,24.78) v1(43.05,22.91) v1(43.9,23.74) v1(44.13,21.75) v1(44.75,24.63) v1(47.29,21.61) v1(47.68,23.45) v1(47.84,25.44) v1(48.09,22.25) v1(48.53,22.87) v1(49.23,24.51) v1(49.27,25.49) v1(49.83,20.53) v1(50.88,25.61) v1(51.21,20.56) v1(52.19,25.55) v1(52.31,20.33) v1(52.4,24.62) v1(52.52,23.51) v1(52.48,22.51) v1(52.52,21.28)
VBAT: length 3.2
  Bottom Layer w0.635: H2.2 29.97,8.97 C30.2
  vias: v1(14.41,18.86) v1(15.19,18.87) v1(28.36,7.32) v1(28.46,9.62) v1(28.63,10.5) v1(29.32,10.93) v1(29.36,9.96) v1(30.01,11.48) v1(30.11,9.61) v1(30.19,10.6) v1(30.34,7.3) v1(30.81,9.89) v1(30.89,8.95) v1(30.94,8.03) v1(30.95,7.3) v1(31.84,8.97) v1(32.1,9.85) v1(32.78,8.95) v1(33.33,9.85) v1(33.85,8.78) v1(34.48,9.88) v1(40.83,19.13) v1(41.59,19.11)
BOOT0: length 2.4
  Bottom Layer w0.203: R2.2 16.91,26.91 18.46,26.91
I2C2_SCL: length 31.3
  Inner1 w0.203: 31.89,26.6 32.59,25.91 arc(33.13,25.54) 33.78,25.41 arc(34.54,25.26) 35.19,24.83 38.31,21.71 arc(39.13,21.16) 40.1,20.97 47.27,20.97 arc(48.24,21.16) 49.06,21.71 v1(49.72,22.36) ; 31.85,26.65 v1(29.4,29.1) arc(29.14,29.27) 28.84,29.32 28.5,29.32 arc(27.9,29.21) 27.39,28.87 26.76,28.24 arc(26.55,27.92) 26.48,27.55 26.48,27.04 arc(26.41,26.71) v1(26.22,26.43)
  Bottom Layer w0.203: v1(29.4,29.1) 29.36,29.13 29.36,29.13 ; U39.3 50.8,22.36 v1(49.72,22.36) ; v1(26.22,26.43) 26.2,26.41 U14.16 ; R58.1 32.05,26.8 v1(31.89,26.65)
I2C2_SDA: length 39.6
  Inner1 w0.203: v1(30.96,26.53) 28.78,28.72 arc(28.64,28.81) 28.47,28.84 28.34,28.84 arc(27.91,28.76) 27.54,28.51 27.02,27.99 arc(26.9,27.81) 26.86,27.6 26.86,26.66 arc(26.64,26.13) 26.12,25.92 24.5,25.92 arc(23.62,25.75) 22.89,25.25 arc(22.34,24.44) 22.15,23.48 v1(22.15,20.84) ; v1(49.84,21.48) 49.7,21.33 arc(48.88,20.78) 47.9,20.59 39.97,20.59 arc(39,20.78) 38.18,21.33 35.22,24.29 arc(34.46,24.81) 33.57,25.03 arc(33.5,25.04) 33.42,25.04 33.35,25.04 arc(32.46,25.26) 31.7,25.78 30.96,26.52
  Bottom Layer w0.203: v1(49.84,21.48) 50.91,21.48 U39.4 ; U14.30 v1(22.15,20.84) ; v1(30.96,26.53) 30.69,26.8 R59.1
  vias: v1(28.71,28.84)
IMU_CS: length 10.1
  Inner1 w0.203: v1(25.91,28.7) arc(25.96,28.97) 26.11,29.19 26.6,29.69 arc(27.08,30) 27.63,30.11 29.56,30.11 arc(29.76,30.07) 29.93,29.96 arc(30.04,29.88) 30.18,29.86 32.52,29.86 arc(32.69,29.83) v1(32.83,29.73)
  Bottom Layer w0.203: v1(32.83,29.73) 32.83,28.6 U33.12 ; U14.12 24.75,28.7 v1(25.91,28.7)
IMU_MISO: length 6.1
  Bottom Layer w0.203: U33.1 30.65,28.85 arc(30.58,28.85) 30.51,28.84 arc(30.26,28.76) 30.05,28.6 arc(29.75,28.4) 29.4,28.33 27.28,28.33 arc(26.89,28.26) 26.56,28.04 26.34,27.82 arc(25.89,27.52) U14.14
IMU_MOSI: length 7
  Bottom Layer w0.203: U14.15 arc(25.9,27.02) 26.35,27.32 26.81,27.77 arc(27.09,27.96) 27.42,28.03 29.83,28.03 arc(30.09,28.08) 30.31,28.23 arc(30.48,28.35) 30.69,28.39 31.33,28.39 arc(31.59,28.44) U33.14
IMU_SCK: length 8.6
  Inner1 w0.203: v1(26.79,29.04) 27.15,29.4 arc(27.52,29.64) 27.95,29.73 29.23,29.73 arc(29.5,29.68) 29.73,29.52 arc(29.92,29.39) 30.15,29.35 v1(32.32,29.35)
  Bottom Layer w0.203: v1(32.32,29.35) U33.13 ; U14.13 arc(25.82,28) 26.21,28.27 26.65,28.7 arc(26.75,28.86) v1(26.79,29.04)
LED1: length 4.5
  Top Layer w0.203: LED3.1 22.66,30.04 v1(22.66,29.61)
  Bottom Layer w0.203: U14.8 22.66,28.61 v1(22.66,29.61)
LED2: length 17.7
  Top Layer w0.203: v1(35.49,31.36) 35.49,32.17 LED4.1
  Inner2 w0.203: v1(23.3,29.62) 23.3,31.21 arc(23.32,31.46) 23.37,31.7 arc(23.83,32.5) 24.63,32.97 arc(24.87,33.02) 25.12,33.03 33.82,33.03 arc(34.16,33) 34.49,32.89 arc(35,32.54) 35.35,32.03 arc(35.46,31.7) v1(35.49,31.36)
  Bottom Layer w0.203: U14.9 23.15,29.26 arc(23.19,29.46) v1(23.3,29.62)
NRST: length 19.5
  Top Layer w0.203: SW1.1 25.97,31.02 arc(25.4,29.66) 24.04,29.1 22.28,29.1 v1(22.15,29.22) 22.15,21.86 22.92,21.09 v1(22.92,20.71)
  Bottom Layer w0.203: v1(22.92,20.71) 22.92,18.24 C3.2 24.33,18.05 R1.1 ; U14.7 v1(22.15,29.22)
OSCIN: length 6.9
  Bottom Layer w0.203: 20,30.84 20,31.09 arc(20.06,31.42) 20.25,31.7 21.06,32.51 X1.1 ; 20,30.84 20,30.34 arc(20.02,30.17) 20.09,30.02 arc(20.18,29.91) 20.29,29.82 arc(20.44,29.75) 20.61,29.73 arc(20.7,29.72) 20.79,29.7 arc(21,29.57) 21.12,29.37 arc(21.15,29.28) 21.16,29.19 U14.5 ; 20,30.84 arc(19.89,31.4) 19.57,31.87 C2.2
OSCOUT: length 5.2
  Bottom Layer w0.203: C1.1 23.56,30.94 X1.3 23.01,30.76 21.77,29.52 arc(21.68,29.4) 21.66,29.25 U14.6
PWM1: length 18.8
  Inner2 w0.203: v1(17.59,22.02) 25.4,22.02 arc(26.07,22.15) 26.65,22.54 arc(27.16,22.88) 27.76,23 33.47,23 v1(33.51,23.04)
  Bottom Layer w0.203: R54.1 33.72,23.12 arc(33.63,23.06) v1(33.51,23.04) ; 18.46,22.91 18.33,22.91 arc(17.8,22.69) 17.59,22.17 v1(17.59,22.02)
PWM2: length 21.3
  Inner2 w0.203: v1(17.24,22.93) 24.6,22.93 arc(25.09,23.02) 25.51,23.3 arc(25.74,23.45) 26.01,23.51 26.08,23.51 arc(26.28,23.54) 26.47,23.63 arc(26.57,23.71) 26.65,23.81 arc(26.74,24) 26.77,24.2 26.77,24.53 arc(26.8,24.76) 26.88,24.97 arc(27.07,25.24) 27.34,25.44 arc(27.55,25.51) 27.78,25.54 32.22,25.54 arc(32.93,25.68) v1(33.54,26.09)
  Bottom Layer w0.203: v1(17.24,22.93) 17.21,22.96 17.21,23.33 arc(17.26,23.67) 17.42,23.98 arc(17.52,24.09) 17.63,24.19 arc(17.94,24.35) 18.29,24.41 18.46,24.41 ; R56.1 34.25,26.8 v1(33.54,26.09)
PWM3: length 17.9
  Inner1 w0.203: v1(24.02,29.64) 22.99,28.6 arc(22.17,28.05) 21.2,27.86 19.69,27.86 arc(18.72,27.67) 17.89,27.12 v1(13.27,22.49)
  Bottom Layer w0.203: v1(13.27,22.49) 15.16,22.49 arc(15.52,22.42) 15.82,22.22 R50.1 ; U14.10 23.65,28.74 arc(23.75,29.23) v1(24.02,29.64)
PWM4: length 12.1
  Inner1 w0.203: v1(17.08,25.54) 18.17,26.64 arc(19,27.19) 19.97,27.38 21.42,27.38 arc(22.4,27.57) 23.22,28.12 24.61,29.52 arc(24.74,29.71) v1(24.79,29.95)
  Bottom Layer w0.203: R52.1 17.08,25.53 v1(17.08,25.54) ; U14.11 arc(24.24,29.03) 24.47,29.38 24.62,29.52 arc(24.75,29.72) v1(24.79,29.95)
SWCLK: length 16.3
  Inner1 w0.203: v1(6.28,24.4) 7.14,23.54 arc(7.6,22.88) 7.8,22.1 ; v1(17.21,21.48) 13.2,21.48 arc(12.79,21.4) 12.45,21.17 arc(12.09,20.93) 11.66,20.84 9.06,20.84 arc(8.69,20.9) 8.35,21.06 arc(8.17,21.21) 8.02,21.39 arc(7.88,21.67) 7.81,21.98 ; 7.81,21.98 arc(7.8,22.04) 7.8,22.1 ; 7.81,21.98 arc(7.8,22.04) 7.8,22.1
  Bottom Layer w0.203: v1(17.21,21.48) 17.52,21.48 arc(18.18,21.75) 18.46,22.41 ; v1(6.28,24.4) 5.17,24.4 U41.4
SWDIO: length 16.2
  Inner1 w0.203: v1(6.28,23.51) 6.94,22.85 arc(7.21,22.45) 7.3,21.98 arc(7.34,21.65) 7.45,21.33 arc(7.74,20.91) 8.17,20.61 arc(8.49,20.5) 8.82,20.46 11.95,20.46 arc(12.35,20.54) 12.68,20.76 arc(12.91,20.91) 13.18,20.97 17.5,20.97 arc(18.17,21.1) v1(18.73,21.48)
  Bottom Layer w0.203: U41.3 5.07,23.51 v1(6.28,23.51) ; U14.36 18.96,21.71 v1(18.73,21.48)
UART1_RX: length 24.8
  Top Layer w0.203: U98.4 29.5,3.04 v1(29.4,2.93)
  Inner1 w0.203: v1(29.4,2.93) 28.5,2.93 arc(28.27,2.98) 28.08,3.11 22.48,8.7 arc(21.93,9.53) 21.74,10.5 v1(21.74,19.19)
  Bottom Layer w0.203: U14.32 21.17,21.7 21.17,20.92 arc(21.26,20.47) 21.51,20.09 arc(21.68,19.84) 21.74,19.54 v1(21.74,19.19)
UART1_TX: length 22.5
  Top Layer w0.203: U98.3 28.5,3.45 v1(28.51,3.44)
  Inner1 w0.203: v1(22.25,19.54) 22.25,10.75 arc(22.45,9.78) 23,8.95 v1(28.51,3.44)
  Bottom Layer w0.203: U14.31 21.65,21.7 21.65,20.94 arc(21.71,20.61) 21.9,20.34 22.06,20.18 arc(22.2,19.96) 22.25,19.71 v1(22.25,19.54)
UART3_RX: length 3.6
  Bottom Layer w0.203: U14.24 26.22,22.41 arc(26.5,22.46) 26.73,22.62 27.73,23.62 arc(27.93,23.92) H1.2
UART3_TX: length 4.9
  Bottom Layer w0.203: H1.1 27.34,26.15 arc(26.89,25.47) 26.73,24.68 26.73,23.89 26.25,23.41 U14.22
USB_DM: length 22.1
  Inner1 w0.203: v1(20.63,20.46) 20.19,20.46 arc(20.02,20.49) 19.87,20.57 arc(19.82,20.61) 19.78,20.66 arc(19.7,20.81) 19.67,20.97 19.67,22.7 arc(19.86,23.67) 20.42,24.49 24.79,28.86 arc(25.26,29.57) 25.42,30.4 25.42,31.06 arc(25.62,32.03) 26.17,32.85 27.38,34.07 arc(27.65,34.47) 27.75,34.94 27.75,34.95 arc(27.67,35.33) U89.A7
  Inner2 w0.203: U89.A7 28.55,36.76 U89.B7
  Bottom Layer w0.203: U14.33 20.65,20.48 v1(20.63,20.46)
USB_DP: length 20.4
  Inner1 w0.203: U89.B6 28.37,36.09 arc(28.5,35.89) U89.A6 28.27,35.38 arc(28.16,35.22) 28.13,35.03 28.13,34.87 arc(28.02,34.35) 27.72,33.9 26.54,32.71 arc(26.02,31.94) 25.84,31.03 25.84,30.39 arc(25.65,29.42) 25.1,28.59 20.74,24.24 arc(20.19,23.42) 20,22.44 20,21.34 arc(20.04,21.14) v1(20.15,20.97)
  Bottom Layer w0.203: U14.34 v1(20.15,20.97)
$1N4477: length 2
  Bottom Layer w0.254: 32.44,17.02 32.44,18 arc(32.34,18.5) R4.2
$1N4551: length 0.5
  Top Layer w0.254: v1(32.48,10.98) 32.21,10.98 LED1.1
$1N4555: length 0.8
  Top Layer w0.203: v1(33.96,10.98) 34.09,10.85 LED2.1
  Bottom Layer w0.203: U43.6 33.74,11.2 v1(33.96,10.98)
$1N4662: length 10.5
  Inner1 w0.203: v1(31.86,12.33) 31.37,11.84 arc(31.21,11.73) 31.03,11.7 arc(30.59,11.88) 30.41,12.31 v1(30.41,19.95)
  Bottom Layer w0.203: R5.1 30.41,20.58 v1(30.41,19.95)
$1N4716: length 9.8
  Inner1 w0.203: v1(34.36,12.36) 34.36,14.21 arc(34.53,15.11) 35.04,15.86 arc(35.48,16.51) 35.63,17.28 v1(35.63,21.22)
  Bottom Layer w0.203: v1(35.63,21.22) 35.63,20.95 R6.1
$1N5211: length 4.3
  Bottom Layer w0.203: U89.A5 30.09,36.1 arc(30.35,36.27) 30.66,36.33 31.66,36.33 arc(32.63,36.14) 33.45,35.59 R46.2
$1N5212: length 4.3
  Bottom Layer w0.203: U89.B5 25.87,36.53 arc(25.65,36.39) 25.39,36.33 23.68,36.33 arc(23.32,36.41) 23.01,36.61 R47.1
$1N5354: length 1.8
  Top Layer w0.203: LED3.2 22.16,33.78 R48.1
$1N5381: length 1.8
  Top Layer w0.203: LED4.2 35.38,33.66 R49.1
$1N5596: length 2.8
  Top Layer w1.27: Q1.3 17.16,15.38 v1(15.2,17.34)
  vias: v1(14.41,17.35)
$1N8554: length 8.4
  Top Layer w0.254: v1(18.47,15) 19.04,14.43 Q1.1
  Bottom Layer w0.254: R51.2 R50.2 17.1,19.43 arc(17.65,18.61) 17.84,17.64 17.84,16.53 arc(18.01,15.7) v1(18.47,15)
$1N8848: length 6.4
  Top Layer w0.508: C33.1 17.84,25.09 17.84,26.06 Q2.3
  Top Layer w1.27: U97.1 15.86,28.52 arc(16.07,28.51) 16.28,28.46 arc(16.36,28.43) 16.45,28.39 arc(16.82,28.13) 17.09,27.75 arc(17.19,27.47) 17.22,27.16 Q2.3
$1N8858: length 5.6
  Top Layer w0.254: 18.73,25.71 18.73,24.94 arc(18.7,24.67) 18.63,24.42 arc(18.32,23.95) 17.85,23.65 arc(17.6,23.57) 17.33,23.55 17.05,23.55 arc(16.67,23.47) v1(16.35,23.25)
  Bottom Layer w0.254: v1(16.35,23.25) 16.34,23.26 R52.2 R53.2
$1N9017: length 3.2
  Top Layer w1.27: Q3.3 40.88,17.48 U91.1
  vias: v1(40.82,17.76) v1(41.59,17.75)
$1N9027: length 9.5
  Top Layer w0.254: Q3.1 36.84,16.4 v1(37.78,16.4)
  Bottom Layer w0.254: v1(37.78,16.4) 37.78,20.47 arc(37.26,21.73) R55.2 R54.2
$1N9186: length 5.9
  Top Layer w0.508: C35.1 38.86,26.61 Q4.3
  Top Layer w1.27: Q4.3 38.78,27.33 arc(38.8,27.55) 38.86,27.77 arc(39.13,28.17) 39.54,28.44 arc(39.75,28.5) 39.98,28.52 U93.1
$1N9196: length 4.7
  Top Layer w0.254: v1(37.02,26.94) 37.02,27.39 36.78,27.63
  Bottom Layer w0.254: R56.2 R57.2 arc(36.07,25.3) 36.15,25.31 arc(36.72,25.59) 37.01,26.16 arc(37.01,26.24) 37.02,26.31 v1(37.02,26.94)

## Copper pours and planes (outline as drawn; the poured copper is in the pictures)
3V3 on Top Layer: 24.95,25.66 26.52,25.66 26.52,22.41 24.95,22.41
GND on Top Layer: -4.92,45.82 63.93,45.82 63.93,-3.01 -4.92,-3.01
GND on Bottom Layer: -5.81,45.52 64.72,45.52 64.72,-2.91 -5.81,-2.91
GND on Bottom Layer: 25.05,6.9 27.75,6.9 27.75,2.81 25.05,2.81
GND on Inner1: -5.32,45.72 64.42,45.72 64.42,-2.91 -5.32,-2.91
GND on Inner2: -5.61,45.52 64.23,45.52 64.23,-3.21 -5.61,-3.21
VBAT on Top Layer: 14.8,20.97 20.45,20.97 20.45,16.99 14.8,16.99
VBAT on Top Layer: 13.65,26.68 15.92,26.68 15.92,18.66 13.65,18.66
VBAT on Top Layer: 28,9.82 31.68,9.82 31.68,7.12 28,7.12
VBAT on Top Layer: 31.62,18.17 31.63,18.28 31.68,18.42 31.77,18.53 31.89,18.62 32.02,18.67 32.13,18.68 35.32,18.68 35.43,18.67 35.57,18.62 35.68,18.53 35.77,18.42 35.82,18.28 35.83,18.17 35.83,11.63 35.82,11.52 35.77,11.39 35.68,11.27 35.57,11.19 35.43,11.13 35.32,11.12 32.13,11.12 32.02,11.13 31.89,11.19 31.77,11.27 31.68,11.39 31.63,11.52 31.62,11.63
VBAT on Top Layer: 39.8,26.68 42.32,26.68 42.32,19.45 39.8,19.45
VBAT on Top Layer: 38.03,20.97 42.32,20.97 42.32,18.63 38.03,18.63
VBAT on Top Layer: 38.52,16.99 38.87,17.14 39.02,17.5 39.02,18.65 40.57,18.65 40.92,18.8 41.07,19.16 41.07,20.46 40.92,20.82 40.57,20.97 37.23,20.97 36.88,20.82 36.73,20.46 36.73,19.97 35.3,19.97 34.94,19.82 34.79,19.46 34.79,17.5 34.94,17.14 35.3,16.99
VBAT on Top Layer: 20.17,18.68 24.38,18.68 24.38,11.12 20.17,11.12
VBAT on Top Layer: 20.17,14.9 35.83,14.9 35.83,7 20.17,7
VBAT on Bottom Layer: 28.09,10.25 31.19,10.25 31.19,3.87 28.09,3.87
VBAT on Bottom Layer: 30.93,9.94 33.78,9.94 33.78,8.47 30.93,8.47
VBAT on Bottom Layer: 34.37,11.79 35.07,11.79 35.07,10.24 34.37,10.24
VBAT on Bottom Layer: 28.09,11.82 37.99,11.82 37.99,8.47 28.09,8.47

Small or netless copper shapes (teardrops, artwork), in the pictures only: 49 on Top Layer, 125 on Bottom Layer, 22 on Inner1, 12 on Inner2

## Text on the board
Bottom Silkscreen Layer: - +
Document Layer: M4 | M3 | M2 | M1
Top Silkscreen Layer: CLK | DIO | 3V3 | GND | SDA | SCL | ING | DONE | LED1 | LED2 | POWER | TX | RX | 4V2 | + | RST | IIC | SWD
